# EAGLE design untitled (EAGLE 7.6.0)
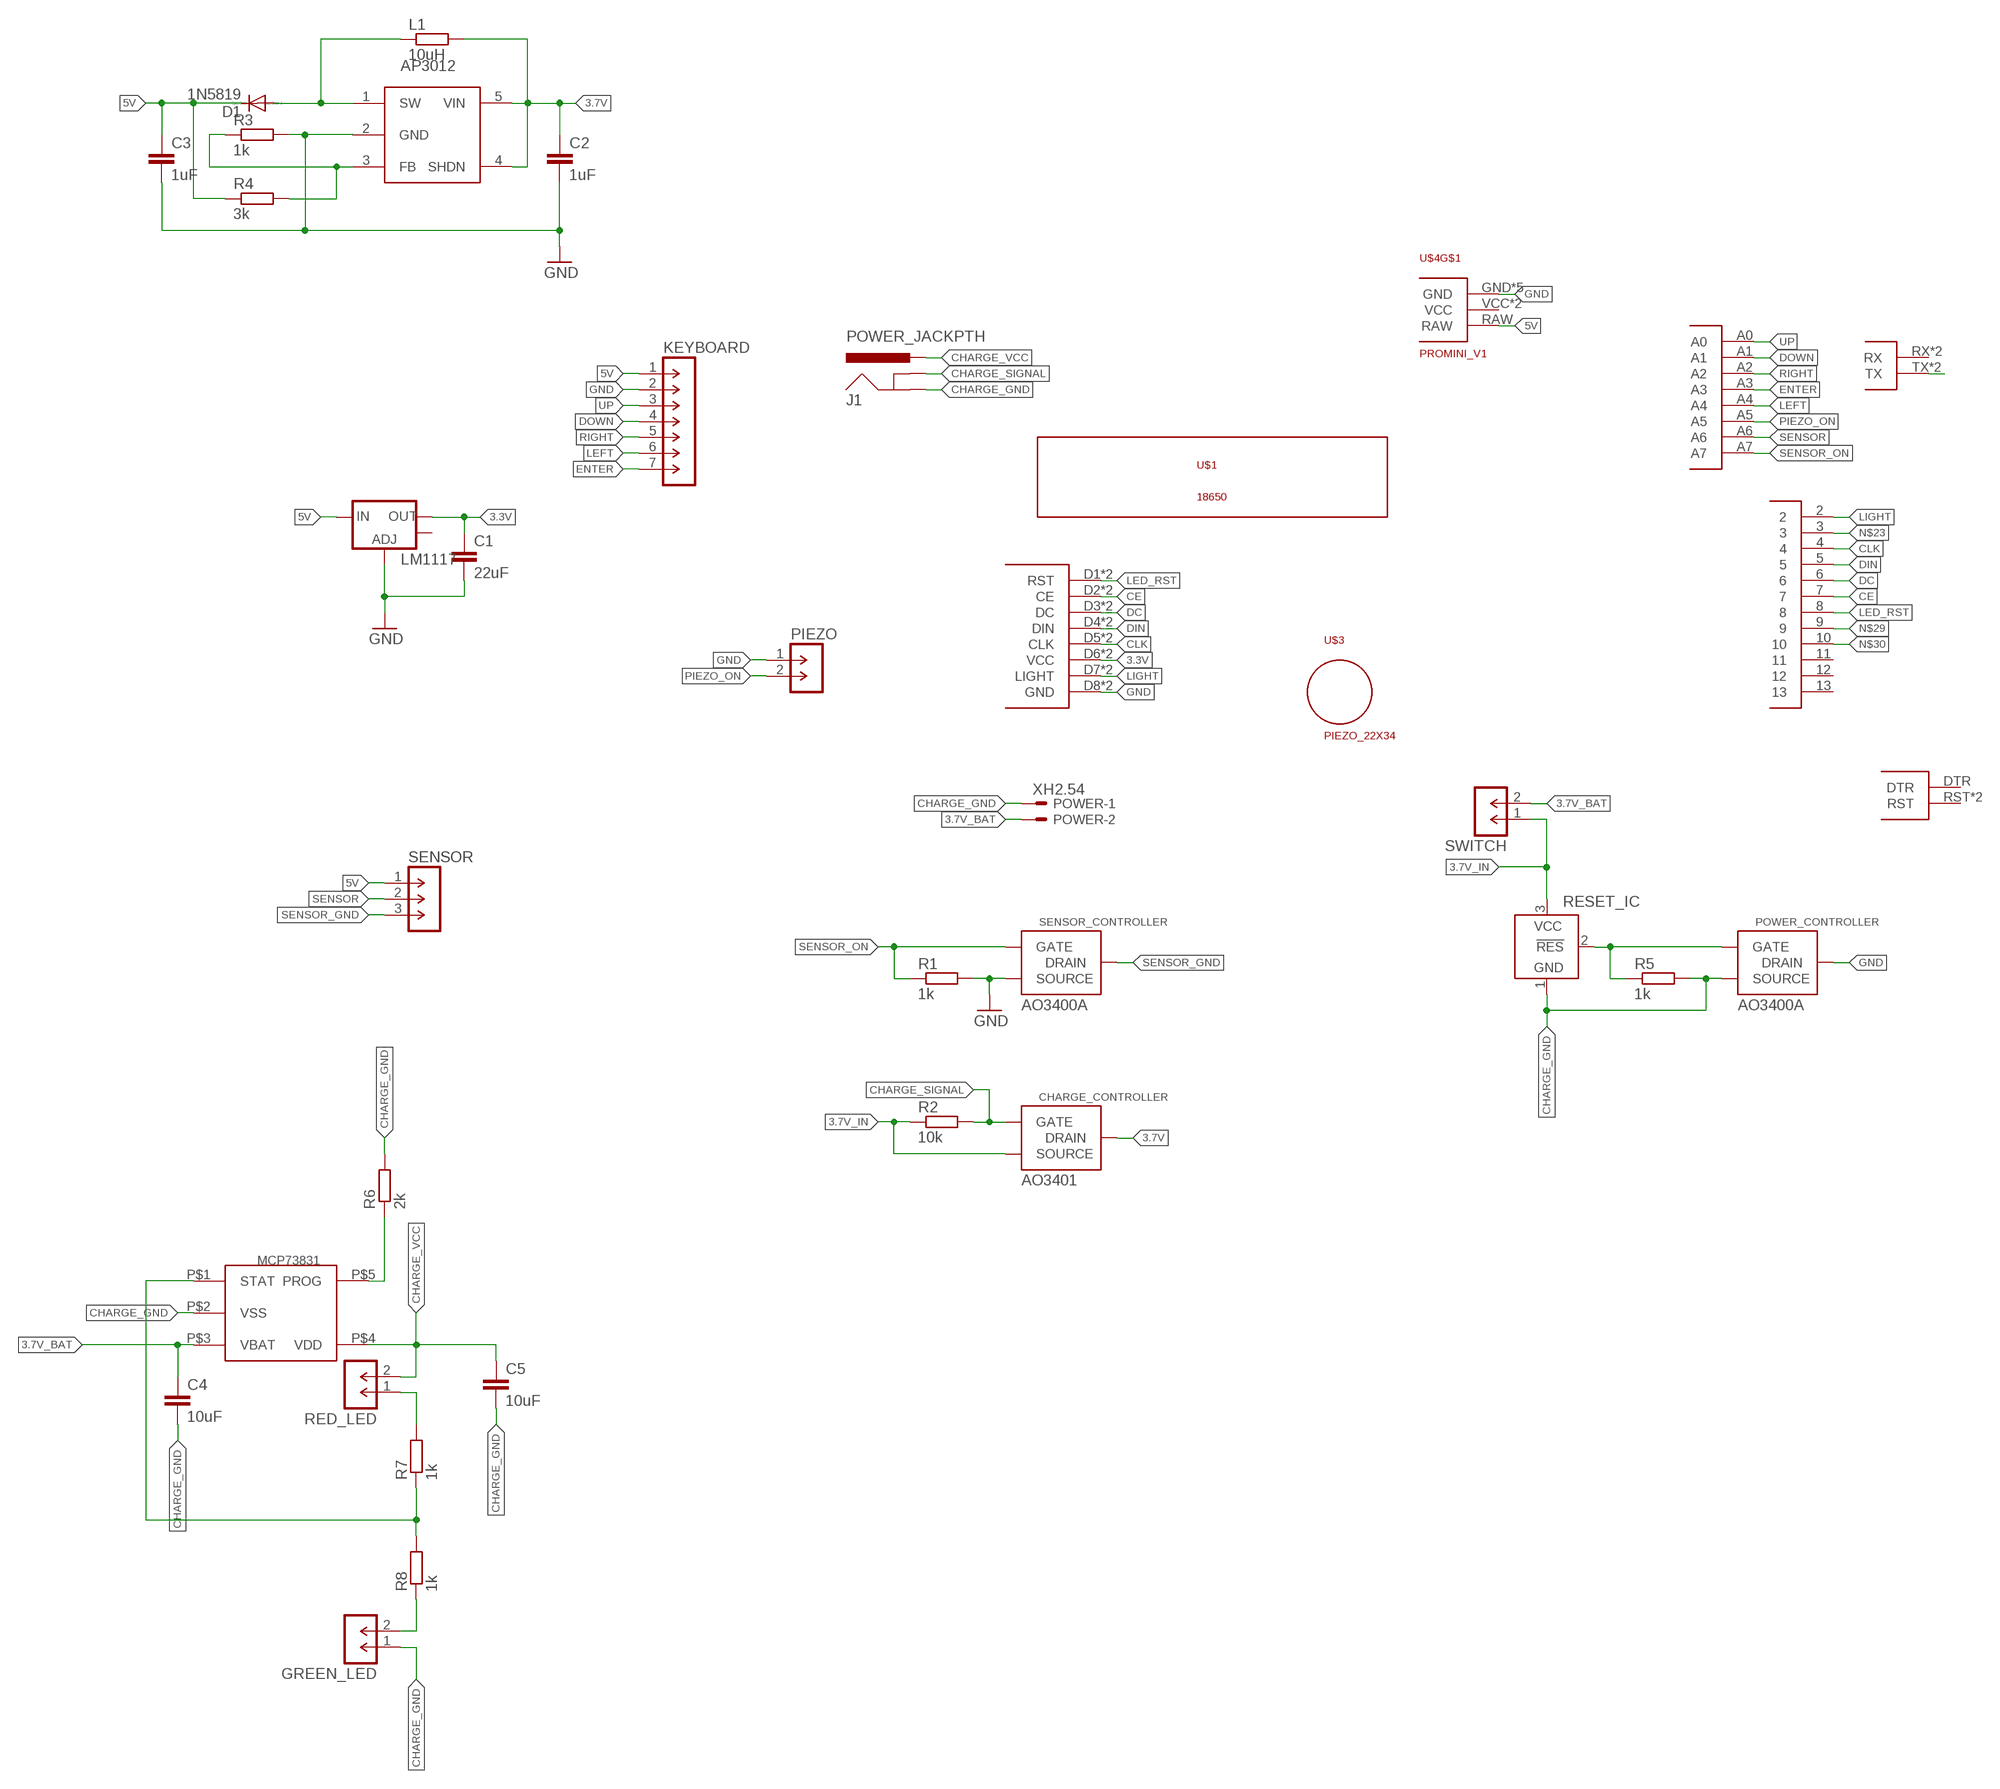
[diagram p0: schematic, sheet 1]

## Parts
C1  22uF  C-EUC0805K  [C0805K]
C2  1uF  C-EUC1206  [C1206]
C3  1uF  C-EUC1206  [C1206]
C4  10uF  C-EUC0805  [C0805]
C5  10uF  C-EUC0805  [C0805]
CHARGE_CONTROLLER  AO3401  AO3400A  [SOT-23]
D1  1N5819  DIODE-DO214AC  [DO214AC]
GREEN_LED  M-1X02-SIP-100-32Y  [SIP-100-02-32Y]
J1  POWER_JACKPTH  [POWER_JACK_PTH]
KEYBOARD  M-1X07-SIP-100-32Y  [SIP-100-07-32Y]
L1  10uH  R-EU_R0805  [R0805]
LM1117  V_REG_LM1117SOT223  [SOT223]
MCP73831  MCP73831  [5PIN_SOT23]
PIEZO  M-1X02-SIP-100-32Y  [SIP-100-02-32Y]
POWER  XH2.54  [XH2.54]
POWER_CONTROLLER  AO3400A  [SOT-23]
R1  1k  R-EU_R1206  [R1206]
R2  10k  R-EU_R1206  [R1206]
R3  1k  R-EU_R1206  [R1206]
R4  3k  R-EU_R1206  [R1206]
R5  1k  R-EU_R1206  [R1206]
R6  2k  R-EU_R1206  [R1206]
R7  1k  R-EU_R1206  [R1206]
R8  1k  R-EU_R1206  [R1206]
RED_LED  M-1X02-SIP-100-32Y  [SIP-100-02-32Y]
RESET_IC  TCM809  [SOT23B-3]
SENSOR  M-1X03-SIP-100-32Y  [SIP-100-03-32Y]
SENSOR_CONTROLLER  AO3400A  [SOT-23]
SWITCH  M-1X02-SIP-100-32Y  [SIP-100-02-32Y]
U$1  18650  [18650]
U$2  NOKIA_5110  [NOKIA_5110]
U$3  PIEZO_22X34  [PIEZO_22X34]
U$4  PROMINI_V1  [PROMINI_V1]
U$8  AP3012  [SOT-23-5]

## Nets
3.3V: C1.1 LM1117.2(OUT) U$2.D6(VCC) U$2.U6(VCC)
3.7V: C2.1 CHARGE_CONTROLLER.3(DRAIN) L1.2 U$8.4(SHDN) U$8.5(VIN)
3.7V_BAT: C4.1 MCP73831.P$3(VBAT) POWER.2 SWITCH.2
3.7V_IN: CHARGE_CONTROLLER.2(SOURCE) R2.1 RESET_IC.3(VCC) SWITCH.1
5V: C3.1 D1.C KEYBOARD.1 LM1117.3(IN) R4.1 SENSOR.1 U$4.RAW
CE: U$2.D2(CE) U$2.U2(CE) U$4.7
CHARGE_GND: C4.2 C5.2 GREEN_LED.1 J1.GND MCP73831.P$2(VSS) POWER.1 POWER_CONTROLLER.2(SOURCE) R5.2 R6.2 RESET_IC.1(GND)
CHARGE_SIGNAL: CHARGE_CONTROLLER.1(GATE) J1.GNDBREAK R2.2
CHARGE_VCC: C5.1 J1.PWR MCP73831.P$4(VDD) RED_LED.2
CLK: U$2.D5(CLK) U$2.U5(CLK) U$4.4
DC: U$2.D3(DC) U$2.U3(DC) U$4.6
DIN: U$2.D4(DIN) U$2.U4(DIN) U$4.5
DOWN: KEYBOARD.4 U$4.A1
ENTER: KEYBOARD.7 U$4.A3
GND: C1.2 C2.2 C3.2 KEYBOARD.2 LM1117.1(ADJ) PIEZO.1 POWER_CONTROLLER.3(DRAIN) R1.2 R3.2 SENSOR_CONTROLLER.2(SOURCE) U$2.D8(GND) U$2.U8(GND) U$4.GND U$4.GND2(GND) U$4.GND3(GND) U$4.GND4(GND) U$4.GND5(GND) U$8.2(GND)
LED_RST: U$2.D1(RST) U$2.U1(RST) U$4.8
LEFT: KEYBOARD.6 U$4.A4
LIGHT: U$2.D7(LIGHT) U$2.U7(LIGHT) U$4.2
N$1: GREEN_LED.2 R8.1
N$3: U$4.TX U$4.TX2(TX)
N$9: D1.A L1.1 U$8.1(SW)
N$10: MCP73831.P$5(PROG) R6.1
N$12: R3.1 R4.2 U$8.3(FB)
N$15: R7.2 RED_LED.1
N$16: MCP73831.P$1(STAT) R7.1 R8.2
N$23: U$4.3
N$29: U$4.9
N$30: U$4.10
PIEZO_ON: PIEZO.2 U$4.A5
RIGHT: KEYBOARD.5 U$4.A2
SENSOR: SENSOR.2 U$4.A6
SENSOR_GND: SENSOR.3 SENSOR_CONTROLLER.3(DRAIN)
SENSOR_ON: R1.1 SENSOR_CONTROLLER.1(GATE) U$4.A7
SENSOR_ON1: POWER_CONTROLLER.1(GATE) R5.1 RESET_IC.2(!RES)
UP: KEYBOARD.3 U$4.A0
Unconnected: LM1117.4(OUT) U$4.11 U$4.12 U$4.13 U$4.DTR U$4.RST U$4.RST2(RST) U$4.RX U$4.RX2(RX) U$4.VCC U$4.VCC2(VCC)

## Library data of the parts
C1-C5 = resistor:C-EU: CAPACITOR, European symbol
CHARGE_CONTROLLER POWER_CONTROLLER SENSOR_CONTROLLER = smd-footprints:AO3400A
D1 = diode:DIODE-: DIODE
GREEN_LED PIEZO RED_LED SWITCH = con-headers-jp:M-1X02-: MALE HEADER
J1 = SparkFun-Connectors:POWER_JACK: Power Jack This is the standard 5.5mm barrel jack for power. The PTH is the most common, proven, reliable, footprint. The Slot footprint only works if the mill layer is transmitted to the PCB fab house so be warned. Mating wall wart : TOL-00298 (and others); PROD_ID: CONN-08197
KEYBOARD = con-headers-jp:M-1X07-: MALE HEADER
L1 R1-R8 = resistor:R-EU_: RESISTOR, European symbol
LM1117 = SparkFun-PowerIC:V_REG_LM1117: Voltage Regulator LM1117 Standard adjustable voltage regulator but in SMD form. Spark Fun Electronics SKU : COM-00595; PROD_ID: VREG-08170
MCP73831 = mcp73831:MCP73831: Digikey No:- __MCP73831T-2ACI/OTCT-ND__
POWER = sh4dov lib:XH2.54: .100" (2.54mm) Center Header - 2 Pin; MF: MOLEX; MPN: 22-23-2021; OC_FARNELL: 1462926; OC_NEWARK: 25C3832
RESET_IC = telcom:TCM809: POWER SUPPLY MONITOR replacement for Maxim MAX809 and MAX810; MF: MICROCHIP; MPN: TCM809MENB713; OC_FARNELL: 9762744; OC_NEWARK: 96K3998
SENSOR = con-headers-jp:M-1X03-: MALE HEADER
U$1 = sh4dov lib:18650
U$2 = sh4dov lib:NOKIA_5110
U$3 = sh4dov lib:PIEZO_22X34
U$4 = sh4dov lib:PROMINI_V1
U$8 = smd-footprints:AP3012

## Board
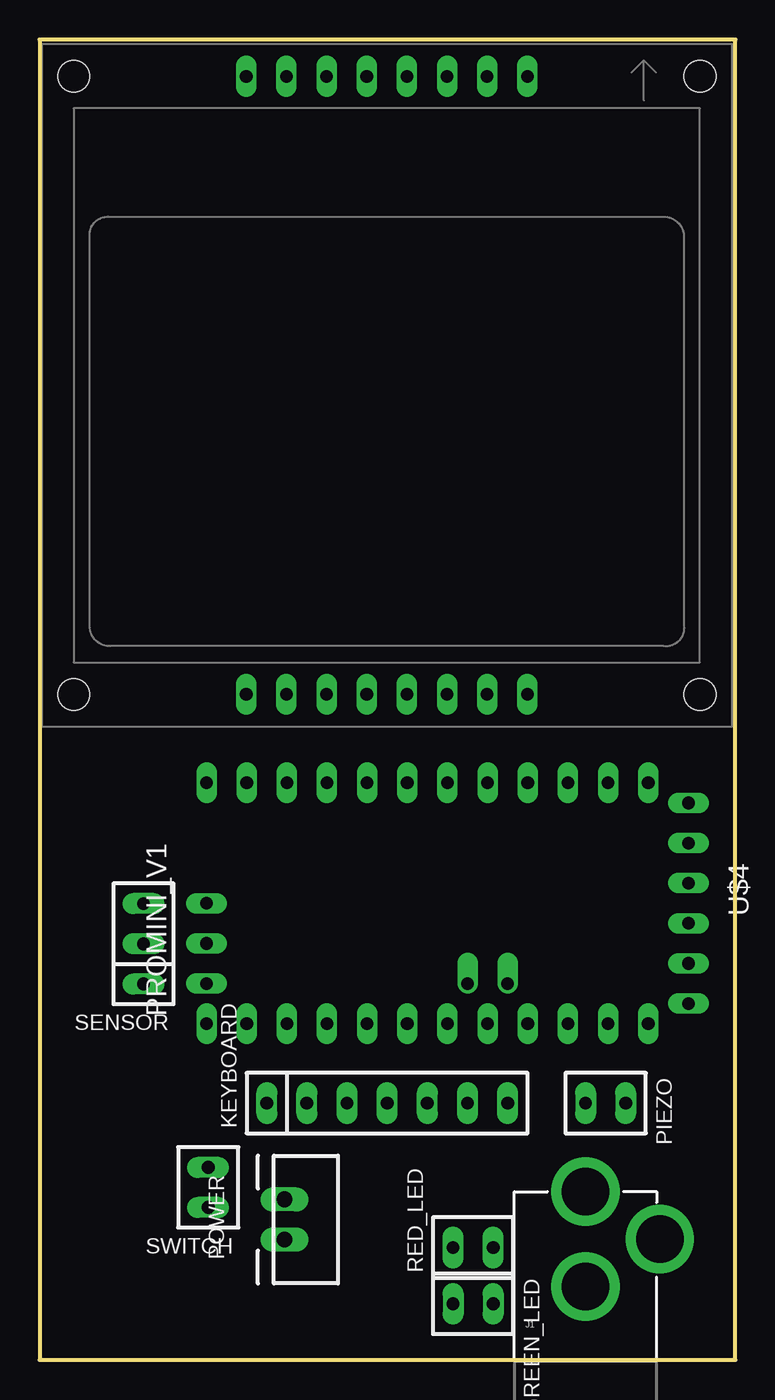
[diagram p1: board, top side]
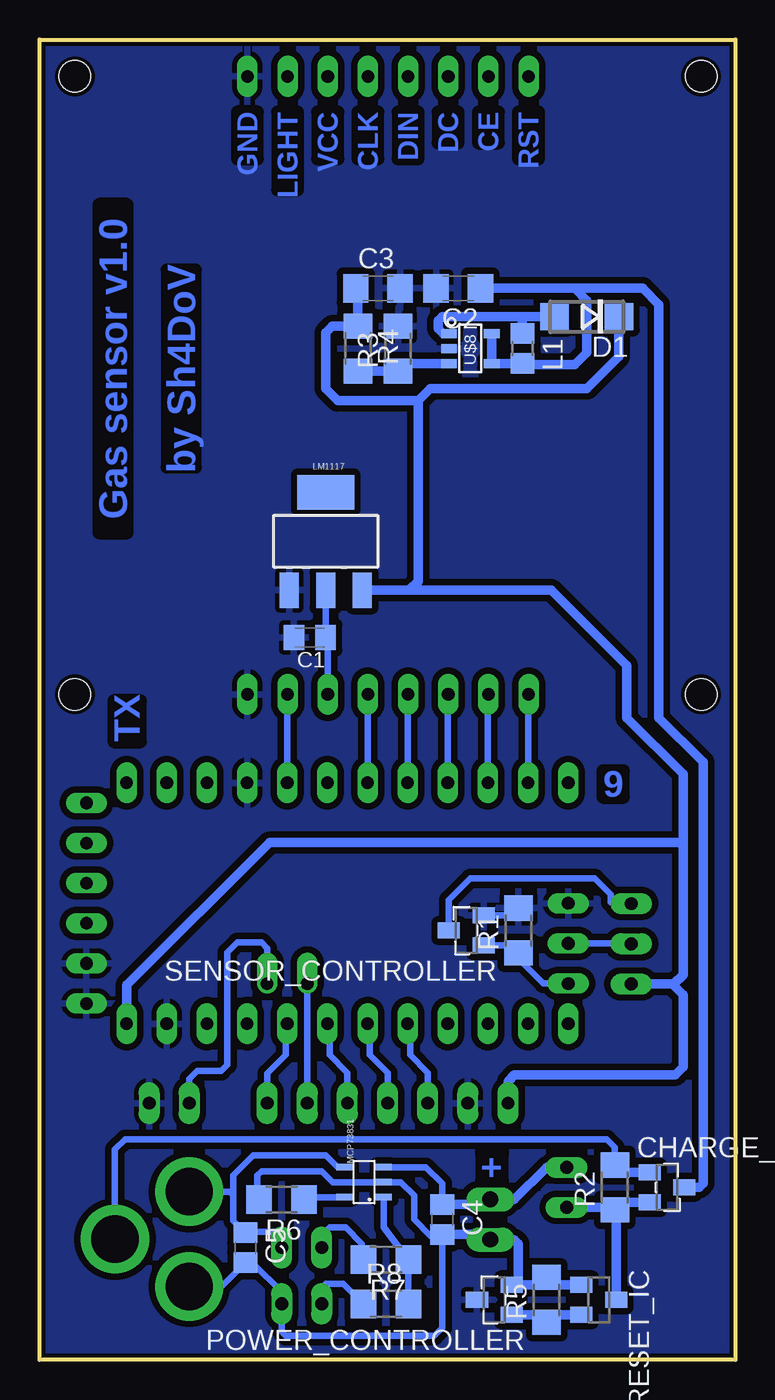
[diagram p2: board, bottom side, seen from below]

Size 44.02 x 83.57 mm. Coordinates in mm from the lower left corner, seen from the top.
Outline: 0,0 44.02,0 44.02,83.57 0,83.56 0,0
Copper layers (1*16): Top 0.035mm / dielectric 1.5mm / Bottom 0.035mm
Design rules "default 16mils": minimum track width 10mil, minimum drill 24mil, track to track 16mil, track to pad 16mil, pad to pad 16mil, via to via 16mil, smd to smd 10mil, copper to edge 10mil, drill to drill 10mil, minimum pad ring 10mil, minimum via ring 8mil, stop-mask expansion 4mil, vias tented up to drill 0mil, thermal gap 12mil

### Footprints (pad centres in the part's own frame; a part is rotated, then mirrored left to right if it is on the bottom)
C0805K = smd 1.3 x 1.6: 1 -1,0; 2 1,0
C1206 = smd 1.6 x 1.8: 1 -1.4,0; 2 1.4,0
C0805 = smd 1.3 x 1.5: 1 -0.95,0; 2 0.95,0
SOT-23 = smd 1 x 1.4: 1 -0.95,-1.1; 2 0.95,-1.1; 3 0,1.1
DO214AC = smd 1.8 x 1.7: A 2.05,0; C -2.05,0
SIP-100-02-32Y = drill 0.813 long: 1 -1.27,0; 2 1.27,0
POWER_JACK_PTH = drill 2.997 pad 4.318: GND 0,7.7; GNDBREAK 4.7,10.7; PWR 0,13.7
SIP-100-07-32Y = drill 0.813 long: 1 -7.62,0; 2 -5.08,0; 3 -2.54,0; 4 0,0; 5 2.54,0; 6 5.08,0; 7 7.62,0
R0805 = smd 1.3 x 1.5: 1 -0.95,0; 2 0.95,0
SOT223 = smd 1.219 x 2.235: 1 -2.311,-3.099; 2 0,-3.099; 3 2.311,-3.099 | smd 3.6 x 2.2: 4 0,3.099
5PIN_SOT23 = smd 0.4 x 1: P$1 0.4,-0.63; P$2 1.35,-0.63; P$3 2.3,-0.63; P$4 2.3,1.87; P$5 0.4,1.87
XH2.54 = drill 1 long: 1 -1.27,0; 2 1.27,0
R1206 = smd 1.6 x 1.803: 1 -1.422,0; 2 1.422,0
SOT23B-3 = smd 1 x 1.4: 1 -0.95,-1.1; 2 0.95,-1.1; 3 0,1.1
SIP-100-03-32Y = drill 0.813 long: 1 -2.54,0; 2 0,0; 3 2.54,0
NOKIA_5110 = drill 0.8 long: D1 -8.89,-17.78; D2 -6.35,-17.78; D3 -3.81,-17.78; D4 -1.27,-17.78; D5 1.27,-17.78; D6 3.81,-17.78; D7 6.35,-17.78; D8 8.89,-17.78; U1 -8.89,21.336; U2 -6.35,21.336; U3 -3.81,21.336; U4 -1.27,21.336; U5 1.27,21.336; U6 3.81,21.336; U7 6.35,21.336; U8 8.89,21.336 | hole 2: -19.812,-17.78; 19.812,-17.78; 19.812,21.336; -19.812,21.336
PIEZO_22X34 = hole 2.2: -14.986,0; 14.986,0
PROMINI_V1 = drill 0.8 long: 2 -7.62,3.81; 3 -7.62,1.27; 4 -7.62,-1.27; 5 -7.62,-3.81; 6 -7.62,-6.35; 7 -7.62,-8.89; 8 -7.62,-11.43; 9 -7.62,-13.97; 10 7.62,-13.97; 11 7.62,-11.43; 12 7.62,-8.89; 13 7.62,-6.35; A0 7.62,-3.81; A1 7.62,-1.27; A2 7.62,1.27; A3 7.62,3.81; A6 2.54,-13.97; A7 5.08,-13.97; DTR -6.35,16.51; GND 7.62,11.43; GND2 0,-13.97; GND3 6.35,16.51; GND4 3.81,16.51; GND5 -7.62,6.35; RAW 7.62,13.97; RST 7.62,8.89; RST2 -7.62,8.89; RX -1.27,16.51; RX2 -7.62,11.43; TX -3.81,16.51; TX2 -7.62,13.97; VCC 7.62,6.35; VCC2 1.27,16.51 | drill 0.8 offset: A4 5.08,2.54; A5 5.08,5.08
SOT-23-5 = smd 1 x 0.55: 1 -1.35,0.95; 2 -1.35,0; 3 -1.35,-0.95; 4 1.35,-0.95; 5 1.35,0.95

### Placement (x,y rotation side)
C1  26.92,45.72 180 bottom
C2  17.53,67.82 180 bottom
C3  22.61,67.82 0 bottom
C4  18.54,8.89 270 bottom
C5  30.99,7.11 270 bottom
CHARGE_CONTROLLER  4.32,10.92 270 bottom
D1  9.4,66.04 180 bottom
GREEN_LED  27.43,3.56 180 top
J1  34.54,-3.05 0 top
KEYBOARD  22,16.26 0 top
L1  13.46,64.01 270 bottom
LM1117  25.91,51.82 0 bottom
MCP73831  22.86,9.91 90 bottom
PIEZO  35.81,16.26 180 top
POWER  15.49,8.89 90 top
POWER_CONTROLLER  15.24,3.81 90 bottom
R1  13.72,27.18 90 bottom
R2  7.62,10.92 90 bottom
R3  21.34,64.01 90 bottom
R4  23.88,64.01 270 bottom
R5  11.94,3.81 90 bottom
R6  28.7,10.16 180 bottom
R7  22.1,6.35 180 bottom
R8  22.1,3.56 0 bottom
RED_LED  27.43,7.11 0 top
RESET_IC  8.64,3.81 270 bottom
SENSOR  6.58,26.34 90 top
SENSOR_CONTROLLER  17.02,27.18 90 bottom
SWITCH  10.67,10.92 90 top
U$1  64.01,18.03 90 top  (outside the outline)
U$2  21.97,59.9 0 top
U$3  62.74,4.32 180 top  (outside the outline)
U$4  24.54,28.91 270 top
U$8  16.76,64.01 0 bottom

### Tracks (layer width: path | path; a pad name or v marks a point on that pad's centre or on a via)
3.3V
  Bottom 0.406: U$2.D6 25.78,45.58 C1.1 25.92,48.7 LM1117.2
3.7V
  Bottom 0.61: U$8.5 U$8.4 L1.2 13.4,62.99 10.16,62.99 9.4,63.75 9.4,67.06 10.16,67.82 10.41,67.82 | C2.1 10.41,67.82 | CHARGE_CONTROLLER.3 2.29,10.92 2.03,11.18 2.03,37.85 4.83,40.64 4.83,66.8 5.84,67.82 10.41,67.82
3.7V_BAT
  Bottom 0.406: 18.62,9.92 C4.1 18.54,11.18 19.57,12.21 MCP73831.P$3
  Bottom 0.61: C4.1 15.81,9.84 POWER.2 13.97,10.16 11.94,12.19 SWITCH.2
3.7V_IN
  Bottom 0.406: 7.54,9.42 R2.1 | 7.15,9.97 R2.1 | 7.77,9.65 R2.1
  Bottom 0.61: RESET_IC.3 7.54,9.42 | CHARGE_CONTROLLER.2 7.15,9.97 | SWITCH.1 7.77,9.65
5V
  Bottom 0.61: C3.1 23.88,67.82 R4.1 25.5,65.43 25.91,65.02 25.91,61.47 25.15,60.71 20.07,60.71 | 20.07,60.71 19.3,61.47 9.4,61.47 7.37,63.5 7.37,66.02 D1.C | LM1117.3 20.62,48.72 | 20.62,48.72 20.07,49.28 20.07,60.71 | 20.62,48.72 11.63,48.72 6.86,43.94 6.86,40.64 3.3,37.08 3.3,32.51 | 3.3,32.51 3.3,24.38 3.89,23.8 SENSOR.1 3.99,23.8 3.3,23.11 3.3,18.54 3.81,18.03 13.97,18.03 14.38,17.63 KEYBOARD.1 | U$4.RAW 38.51,23.72 29.46,32.77 3.56,32.77 3.3,32.51
CE
  Bottom 0.406: U$4.7 15.65,42.1 U$2.D2
CHARGE_GND
  Bottom 0.406: R6.2 30.23,10.26 30.23,11.68 29.97,11.94 26.16,11.94 25.48,11.26 MCP73831.P$2 21.16,11.26 20.32,10.41 20.32,8.89 19.3,7.87 | 19.3,7.87 18.61,7.87 C4.2 | C4.2 19.24,7.94 19.3,7.87 | 30.67,5.84 C5.2 | 13.72,5.18 POWER_CONTROLLER.2 | 12.41,4.76 R5.2 11.47,4.76 | 30.73,5.91 C5.2 | 18.8,7.69 C4.2 | C4.2 18.54,2.03 19.05,1.52 28.45,1.52 28.7,1.78 GREEN_LED.1 28.7,4.32 30.48,6.1 30.92,6.1 C5.2 | J1.GND 32.5,4.65 C5.2
  Bottom 0.61: C4.2 15.81,7.94 POWER.1 13.97,7.62 13.72,7.37 13.72,5.18 | POWER_CONTROLLER.2 12.41,4.76 | RESET_IC.1 11.47,4.76
CHARGE_SIGNAL
  Bottom 0.406: J1.GNDBREAK 39.24,13.33 38.61,13.97 8.13,13.97 7.62,13.46 R2.2 7.15,11.87
  Bottom 0.61: CHARGE_CONTROLLER.1 7.15,11.87
CHARGE_VCC
  Bottom 0.406: MCP73831.P$4 25.16,12.21 25.91,12.95 29.97,12.95 | 29.97,12.95 30.48,12.95 31.75,11.68 31.75,10.41 | 31.75,10.41 31.75,8.82 C5.1 30.92,8.13 28.96,8.13 28.7,7.87 RED_LED.2 | 29.99,12.94 29.97,12.95 | J1.PWR 31.99,10.65 31.75,10.41
CLK
  Bottom 0.406: U$4.4 23.27,42.1 U$2.D5
DC
  Bottom 0.406: U$4.6 18.19,42.1 U$2.D3
DIN
  Bottom 0.406: U$4.5 20.73,42.1 U$2.D4
DOWN
  Bottom 0.406: KEYBOARD.4 22,18.19 23.11,19.3 23.11,21.13 U$4.A1
ENTER
  Bottom 0.406: KEYBOARD.7 29.62,18.14 28.45,19.3 28.45,21.18 U$4.A3
GND
  Bottom 0.406: SENSOR_CONTROLLER.2 14.19,28.13 R1.2
  pour Bottom: -0.25,-0.25 44.2,-0.25 44.2,83.82 -0.25,83.82
LED_RST
  Bottom 0.406: U$4.8 13.11,42.1 U$2.D1
LEFT
  Bottom 0.406: KEYBOARD.6 U$4.A4
LIGHT
  Bottom 0.406: U$4.2 28.35,42.1 U$2.D7
N$1
  Bottom 0.406: GREEN_LED.2 26.16,4.57 25.91,4.83 24.79,4.83 R8.1
N$2
  pour Bottom: -0.25,-0.25 44.2,-0.25 44.2,83.82 -0.25,83.82
N$9
  Bottom 0.61: U$8.1 18.48,64.96 18.8,65.28 18.8,65.79 18.54,66.04 13.46,66.04 | 13.46,66.04 D1.A | L1.1 13.46,66.04
N$10
  Bottom 0.406: MCP73831.P$5 27.13,10.31 R6.1
N$12
  Bottom 0.61: R4.2 R3.1 20.86,63.06 U$8.3
N$15
  Bottom 0.406: RED_LED.1 26.16,7.87 25.65,8.38 24.64,8.38 23.62,7.37 23.62,6.2 R7.2
N$16
  Bottom 0.406: MCP73831.P$1 22.23,8.41 R7.1 R8.2
PIEZO_ON
  Bottom 0.406: U$4.A5 29.62,26.06 29.97,26.42 31.5,26.42 32.13,25.78 32.13,18.67 32.51,18.29 34.04,18.29 34.54,17.78 PIEZO.2
RIGHT
  Bottom 0.406: KEYBOARD.5 24.54,18.19 25.65,19.3 25.65,21.13 U$4.A2
SENSOR
  Bottom 0.406: U$4.A6 6.6,26.36 SENSOR.2
SENSOR_GND
  Bottom 0.406: SENSOR_CONTROLLER.3 18.12,29.13 16.76,30.48 8.89,30.48 7.87,29.46 7.87,28.96 6.66,28.96 SENSOR.3
SENSOR_ON
  Bottom 0.406: SENSOR_CONTROLLER.1 14.19,26.23 | 14.19,26.23 R1.1 13.46,25.15 12.14,23.82 U$4.A7 | 14.05,26.36 14.19,26.23
SENSOR_ON1
  Bottom 0.406: 12.41,2.86 R5.1 11.47,2.86
  Bottom 0.61: POWER_CONTROLLER.1 12.41,2.86 | RESET_IC.2 11.47,2.86
UP
  Bottom 0.406: KEYBOARD.3 19.46,18.19 20.57,19.3 20.57,21.13 U$4.A0
(copper drawn outside any net)
  shapes: Bottom circle x4

### Text on the board
Bottom: RST | CE | DC | DIN | CLK | VCC | LIGHT | GND | by Sh4DoV | Gas sensor v1.0 | TX | 9 | +